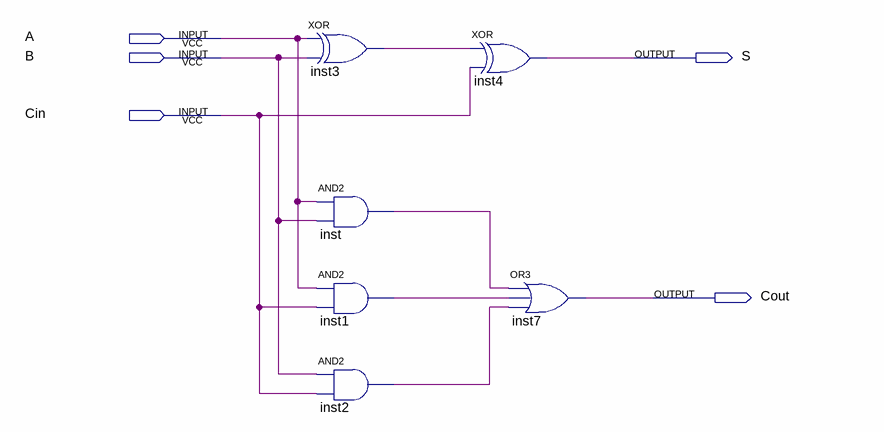
[diagram p0: schematic sheet]
// Quartus schematic FA.bdf as structural Verilog: 6 symbols, 5 pins
module FA (
  input  A,
  input  B,
  input  Cin,
  output S,
  output Cout
);

  wire inst1_out, inst2_out, inst3_out, inst_out;

  xor inst3 (inst3_out, A, B);
  and inst (inst_out, A, B);
  and inst1 (inst1_out, A, Cin);
  and inst2 (inst2_out, B, Cin);
  xor inst4 (S, inst3_out, Cin);
  or inst7 (Cout, inst_out, inst1_out, inst2_out);
endmodule
